# Altium project VESC_MotorController.PrjPcb
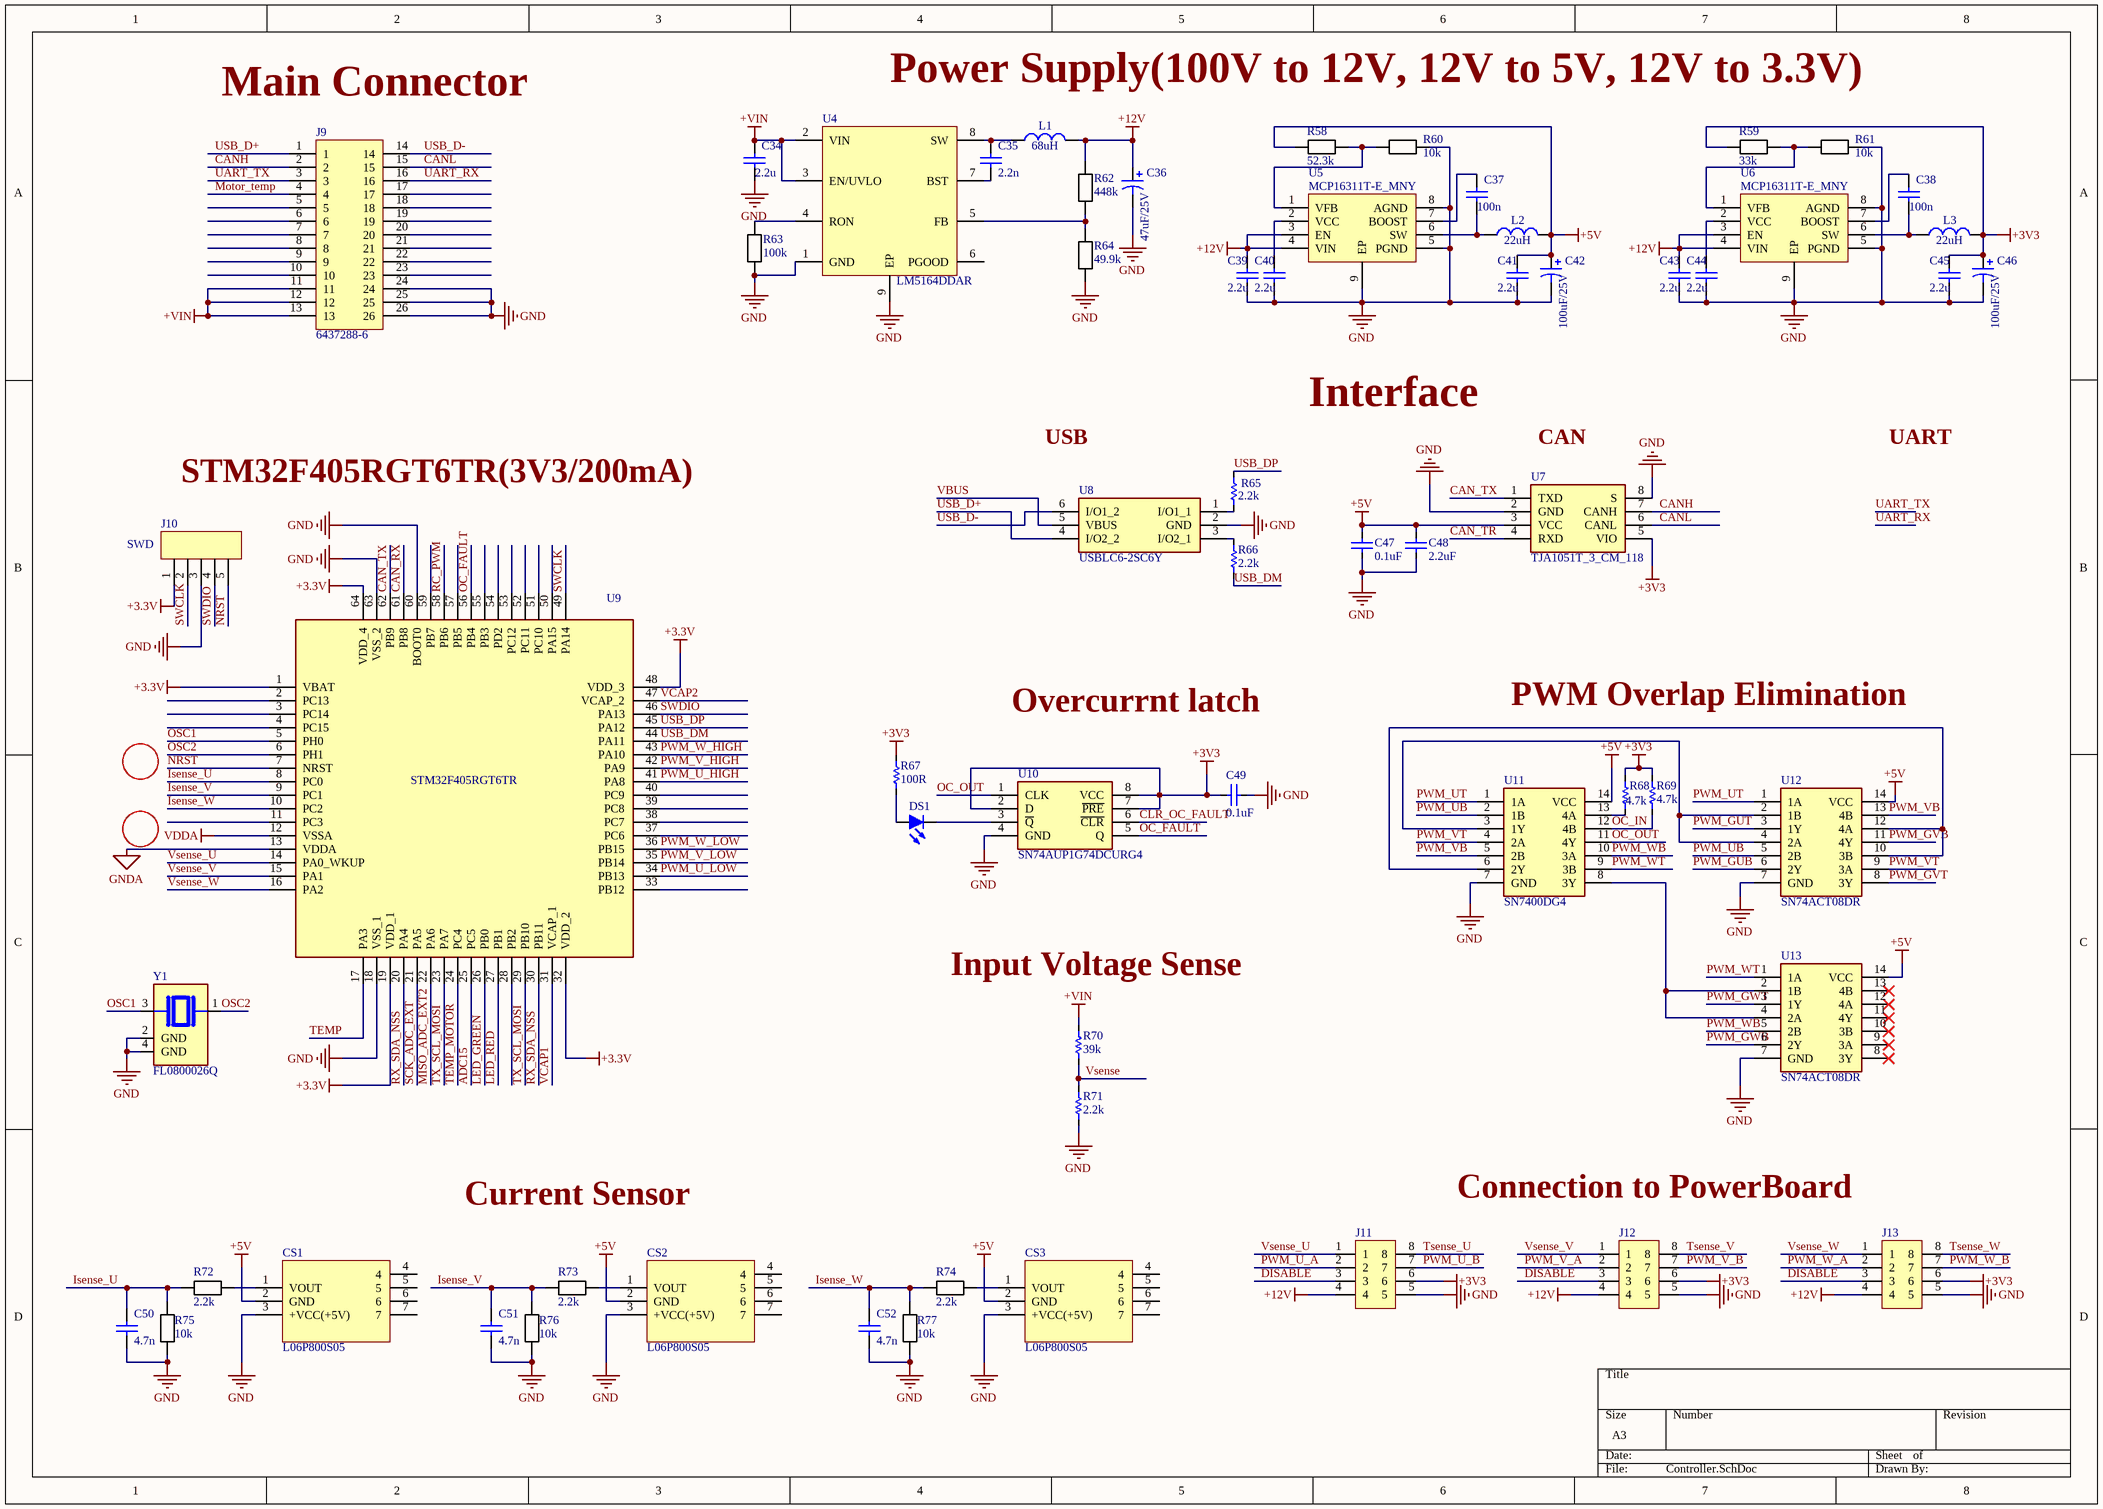
[diagram p0: Controller.SchDoc]
2 sheets, 193 parts. Net scope: global (net labels, ports and power ports of the same name join across sheets).
Board files: Controller.PcbDoc, PowerBoard.PcbDoc
Sheets:
  Controller.SchDoc
  PowerBoard.SchDoc

## Sheet Controller.SchDoc
size A3

### Parts
C34  2.2u  [*]
C35  2.2n  [C0603]
C36  47uF/25V  [*]
C37  100n  [C0603]
C38  100n  [C0603]
C39  2.2u  [*]
C40  2.2u  [*]
C41  2.2u  [*]
C42  100uF/25V  [*]
C43  2.2u  [*]
C44  2.2u  [*]
C45  2.2u  [*]
C46  100uF/25V  [*]
C47  0.1uF  [SMD_C(0402)]
C48  2.2uF  [SMD_C(0603)]
C49  0.1uF  [SMD_C(0402)]
C50  4.7n  [C0603]
C51  4.7n  [C0603]
C52  4.7n  [C0603]
CS1  L06P800S05  [L06P800S05]
CS2  L06P800S05  [L06P800S05]
CS3  L06P800S05  [L06P800S05]
DS1  SML-D12U1WT86  [LED0603]  (value not drawn)
J9  6437288-6  [64372886]
J10  SWD  [Header-2.54m-5pin]
J11  (no value)  [*]
J12  (no value)  [*]
J13  (no value)  [*]
L1  68uH  [*]
L2  22uH  [*]
L3  22uH  [*]
R58  52.3k  [R0603]
R59  33k  [R0603]
R60  10k  [R0603]
R61  10k  [R0603]
R62  448k  [R0603]
R63  100k  [R0603]
R64  49.9k  [R0603]
R65  2.2k  [SMD_R(0402)]
R66  2.2k  [SMD_R(0402)]
R67  100R  [SMD_R(0402)]
R68  4.7k  [SMD_R(0402)]
R69  4.7k  [SMD_R(0402)]
R70  39k  [SMD_R(0402)]
R71  2.2k  [SMD_R(0402)]
R72  2.2k  [R0603]
R73  2.2k  [R0603]
R74  2.2k  [R0603]
R75  10k  [R0603]
R76  10k  [R0603]
R77  10k  [R0603]
U4  LM5164DDAR  [SOIC-8(EPAD)]
U5  MCP16311T-E_MNY  [MSOP-8]
U6  MCP16311T-E_MNY  [MSOP-8]
U7  TJA1051T_3_CM_118  [SOIC127P600X175-8N]
U8  USBLC6-2SC6Y  [SOT95P280X145-6N]
U9  STM32F405RGT6TR  [QFP50P1200X1200X160-64N]
U10  SN74AUP1G74DCURG4  [SOP50P310X90-8N]
U11  SN7400DG4  [SOIC127P600X175-14N]
U12  SN74ACT08DR  [SOIC127P600X175-14N]
U13  SN74ACT08DR  [SOIC127P600X175-14N]
Y1  FL0800026Q  [XTAL_FL0800026Q]

### Nets
+3.3V: J10.1 U9.1(VBAT) U9.19(VDD_1) U9.32(VDD_2) U9.48(VDD_3) U9.64(VDD_4)
+3V3: C45.2 C46.1 C49.2 J11.6 J12.6 J13.6 L3.2 R59.1 R67.2 R68.2 R69.2 U7.5(VIO) U10.2(D) U10.7(~{PRE}) U10.8(VCC)
+5V: C41.2 C42.1 C47.2 C48.2 CS1.2(GND) CS2.2(GND) CS3.2(GND) L2.2 R58.1 U7.3(VCC) U11.14(VCC) U12.14(VCC) U13.14(VCC)
+12V: C36.1 C39.2 C43.2 J11.4 J12.4 J13.4 L1.2 R62.2 U5.3(EN) U5.4(VIN) U6.3(EN) U6.4(VIN)
+VIN: C34.2 J9.11 J9.12 J9.13 R70.2 U4.2(VIN) U4.3(EN/UVLO)
GND: C34.1 C36.2 C39.1 C40.1 C41.1 C42.2 C43.1 C44.1 C45.1 C46.2 C47.1 C48.1 C49.1 C50.1 C51.1 C52.1 CS1.3(+VCC(+5V)) CS2.3(+VCC(+5V)) CS3.3(+VCC(+5V)) J9.24 J9.25 J9.26 J10.3 J11.5 J12.5 J13.5 R60.1 R61.1 R63.1 R64.1 R71.1 R75.1 R76.1 R77.1 U4.1(GND) U4.9(EP) U5.5(PGND) U5.8(AGND) U5.9(EP) U6.5(PGND) U6.8(AGND) U6.9(EP) U7.2(GND) U7.8(S) U8.2(GND) U9.18(VSS_1) U9.60(BOOT0) U9.63(VSS_2) U10.4(GND) U11.7(GND) U12.7(GND) U13.7(GND) Y1.2(GND) Y1.4(GND)
GNDA: U9.13(VDDA)
VDDA: U9.12(VSSA)
ADC15: U9.25(PC5)
CAN_RX: U9.61(PB8)
CAN_TR: U7.4(RXD)
CAN_TX: U7.1(TXD) U9.62(PB9)
CANH: J9.2 U7.7(CANH)
CANL: J9.15 U7.6(CANL)
CLR_OC_FAULT: U10.6(~{CLR})
DISABLE: J11.3 J12.3 J13.3
Isense_U: C50.2 R72.1 R75.2 U9.8(PC0)
Isense_V: C51.2 R73.1 R76.2 U9.9(PC1)
Isense_W: C52.2 R74.1 R77.2 U9.10(PC2)
LED_GREEN: U9.26(PB0)
LED_RED: U9.27(PB1)
MISO_ADC_EXT2: U9.22(PA6)
Motor_temp: J9.4
NRST: J10.5 U9.7(NRST)
OC_FAULT: U9.56(PB4) U10.5(Q)
OC_IN: R69.1 U11.12(4B)
OC_OUT: U10.1(CLK) U11.11(4Y)
OSC1: U9.5(PH0) Y1.3
OSC2: U9.6(PH1) Y1.1
PWM_GUB: U12.6(2Y)
PWM_GUT: U12.3(1Y)
PWM_GVB: U12.11(4Y)
PWM_GVT: U12.8(3Y)
PWM_GWB: U13.6(2Y)
PWM_GWT: U13.3(1Y)
PWM_U_A: J11.2
PWM_U_B: J11.7
PWM_U_HIGH: U9.41(PA8)
PWM_U_LOW: U9.34(PB13)
PWM_UB: U11.2(1B) U12.5(2B)
PWM_UT: U11.1(1A) U12.1(1A)
PWM_V_A: J12.2
PWM_V_B: J12.7
PWM_V_HIGH: U9.42(PA9)
PWM_V_LOW: U9.35(PB14)
PWM_VB: U11.5(2B) U12.13(4B)
PWM_VT: U11.4(2A) U12.9(3A)
PWM_W_A: J13.2
PWM_W_B: J13.7
PWM_W_HIGH: U9.43(PA10)
PWM_W_LOW: U9.36(PB15)
PWM_WB: U11.10(3A) U13.5(2B)
PWM_WT: U11.9(3B) U13.1(1A)
RC_PWM: U9.58(PB6)
RX_SDA_NSS: U9.20(PA4) U9.30(PB11)
SCK_ADC_EXT: U9.21(PA5)
SWCLK: J10.2 U9.49(PA14)
SWDIO: J10.4 U9.46(PA13)
TEMP: U9.17(PA3)
TEMP_MOTOR: U9.24(PC4)
Tsense_U: J11.8
Tsense_V: J12.8
Tsense_W: J13.8
TX_SCL_MOSI: U9.23(PA7) U9.29(PB10)
UART_RX: J9.16
UART_TX: J9.3
USB_D+: J9.1 U8.4(I/O2_2)
USB_D-: J9.14 U8.6(I/O1_2)
USB_DM: R66.2 U9.44(PA11)
USB_DP: R65.2 U9.45(PA12)
VBUS: U8.5(VBUS)
VCAP1: U9.31(VCAP_1)
VCAP2: U9.47(VCAP_2)
Vsense: R70.1 R71.2
Vsense_U: J11.1 U9.14(PA0_WKUP)
Vsense_V: J12.1 U9.15(PA1)
Vsense_W: J13.1 U9.16(PA2)
NetC35_1: C35.1 U4.7(BST)
NetC35_2: C35.2 L1.1 U4.8(SW)
NetC37_1: C37.1 L2.1 U5.6(SW)
NetC37_2: C37.2 U5.7(BOOST)
NetC38_1: C38.1 L3.1 U6.6(SW)
NetC38_2: C38.2 U6.7(BOOST)
NetC40_2: C40.2 U5.2(VCC)
NetC44_2: C44.2 U6.2(VCC)
NetCS1_1: CS1.1(VOUT) R72.2
NetCS2_1: CS2.1(VOUT) R73.2
NetCS3_1: CS3.1(VOUT) R74.2
NetDS1_A: DS1.A R67.1
NetDS1_C: DS1.C U10.3(~{Q})
NetR58_2: R58.2 R60.2 U5.1(VFB)
NetR59_2: R59.2 R61.2 U6.1(VFB)
NetR62_1: R62.1 R64.2 U4.5(FB)
NetR63_2: R63.2 U4.4(RON)
NetR65_1: R65.1 U8.1(I/O1_1)
NetR66_1: R66.1 U8.3(I/O2_1)
NetR68_1: R68.1 U11.13(4A)
NetU11_3: U11.3(1Y) U12.2(1B) U12.4(2A)
NetU11_6: U11.6(2Y) U12.10(3B) U12.12(4A)
NetU11_8: U11.8(3Y) U13.2(1B) U13.4(2A)

Not connected (* = marked no-connect by the designer): CS1 4 5 6 7; CS2 4 5 6 7; CS3 4 5 6 7; J9 5 6 7 8 9 10 17 18 19 20 21 22 23; U4 6(PGOOD); U9 2(PC13) 3(PC14) 4(PC15) 11(PC3) 28(PB2) 33(PB12) 37(PC6) 38(PC7) 39(PC8) 40(PC9) 50(PA15) 51(PC10) 52(PC11) 53(PC12) 54(PD2) 55(PB3) 57(PB5) 59(PB7); U13 8(3Y)* 9(3A)* 10(3B)* 11(4Y)* 12(4A)* 13(4B)*

### Notes on the sheet
- (near J9) Main Connector
- Power Supply(100V to 12V, 12V to 5V, 12V to 3.3V)
- USB
- Interface
- (near U7) CAN
- UART
- STM32F405RGT6TR(3V3/200mA)
- Overcurrnt latch
- PWM Overlap Elimination
- (near R70) Input Voltage Sense
- Current Sensor
- Connection to PowerBoard

### Library data of the parts
C34 = 2.2uF ± 10% 100V: Value: 2.2u
C35 = 2.2nF ± 10% 50V: Manufacturer: Yageo; Price: 0.1; Supplier: Mouser; Value: 2.2n
C36 = Cap Pol1: 47uF ±20% 25V; Value: 47uF/25V
C37 C38 = 100nF ± 10% 50V: Manufacturer: Yageo; Manufacturer Part Number: CC0603KRX7R9BB104; Supplier Part Number: 603-CC603KRX7R9BB104; Price: 0.1; Supplier: Mouser; Value: 100n
C39-C41 C43-C45 = 2.2uF ± 10% 25V: Value: 2.2u
C42 C46 = Cap Pol1: 100uF ±20% 25V; Value: 100uF/25V
C47 C49 = Cap_1: Multilayer Ceramic Capacitors MLCC - SMD/SMT 50 V 0.1uF X7R 0603 10%; Manufacturer: Yageo; Manufacturer Part Number: CC0603KPX7R9BB104; Supplier 1: Digi-Key; Supplier Part Number 1: 311-3567-1-ND
C48 = Cap_4: Multilayer Ceramic Capacitors MLCC - SMD/SMT 2.2 uF 50 VDC 10% 1206 X7R AEC-Q200; Manufacturer: Yageo; Manufacturer Part Number: GCM31CR71H225KA55K; Supplier 1: Digi-Key; Supplier Part Number 1: 311-3567-1-ND
C50-C52 = 4.7nF ± 10% 50V: Manufacturer: Yageo; Price: 0.1; Supplier: Mouser; Value: 4.7n
CS1-CS3 = L06P800S05: Board Mount Current Sensors Current Sensor, +/-800A, +5VDC, PCB, Open Loop, Aperture, 2.5V+/-1.5V Output; Manufacturer: Tamura; Supplier Part Number: 838-L06P800S05; Price: 20; Manufacturer Part Number: L06P800S05; Value: L06P800S05; Supplier: Mouser
DS1 = SML-D12U1WT86: Typical RED GaAs LED; Manufacturer: Rohm Semiconductor; Supplier: Mouser; Supplier Part Number: 755-SML-D12U1WT86; Manufacturer Part Number: SML-D12U1WT86; Value: SML-D12U1WT86; Price: 0.2
J9 = 6437288-6: Header vert 26 way 4 row Tab Superseal; Manufacturer: TE Connectivity; Supplier Part Number: 571-6437288-6; Manufacturer Part Number: 6437288-6; Supplier: Mouser; Value: 6437288-6
J10 = 5PinConnector
J11-J13 = PCB Header: 2 Row 2.54mm Pitch 8 pins
L1-L3 = Inductor
  L1: Value: 68uH
  L2 L3: Value: 22uH
R58 = 52.3 kohm 0.1W ±1%: Manufacturer Part Number: RC0603FR-0752K3L; Manufacturer: Yageo; Value: 52.3k; Supplier: Mouser; Supplier Part Number: 603-RC0603FR-0752K3L; Price: 0.1
R59 = 33 kohm 0.1W ±1%: Manufacturer Part Number: RC0603FR-0733KL; Manufacturer: Yageo; Value: 33k; Supplier: Mouser; Supplier Part Number: 603-RC0603FR-0733KL; Price: 0.1
R60 R61 R75-R77 = 10 kohm 0.1W ±1%: Manufacturer Part Number: RC0603FR-0710KL; Manufacturer: Yageo; Value: 10k; Supplier: Mouser; Supplier Part Number: 603-RC0603FR-0710KL; Price: 0.1
R62 = 448 kohm 0.1W ±1%: Manufacturer Part Number: RC0603FR-07448KL; Manufacturer: Yageo; Value: 448k; Supplier: Mouser; Supplier Part Number: 603-RC0603FR-07448KL; Price: 0.1
R63 = 100 kohm 0.1W ±1%: Manufacturer Part Number: RC0603FR-07100KL; Manufacturer: Yageo; Value: 100k; Supplier: Mouser; Supplier Part Number: 603-RC0603FR-07100KL; Price: 0.1
R64 = 49.9 kohm 0.1W ±1%: Manufacturer Part Number: RC0603FR-0749K9L; Manufacturer: Yageo; Value: 49.9k; Supplier: Mouser; Supplier Part Number: 603-RC0603FR-0749K9L; Price: 0.1
R65 R66 = Res Semi_2: CRCW04024R02FKED; Published: 8-Jun-2000; LatestRevisionDate: 17-Jul-2002; LatestRevisionNote: Re-released for DXP Platform.; PackageReference: AXIAL-0.5; Publisher: Altium Limited; PackageDescription: Axial Device, Thru-Hole; 2 Leads; 0.5 in Pin Spacing
R67 = Res Semi_1: CRCW04024R02FKED; Published: 8-Jun-2000; LatestRevisionDate: 17-Jul-2002; LatestRevisionNote: Re-released for DXP Platform.; PackageReference: AXIAL-0.5; Publisher: Altium Limited; PackageDescription: Axial Device, Thru-Hole; 2 Leads; 0.5 in Pin Spacing
R68 R69 = Res Semi_3: CRCW04024R02FKED; Published: 8-Jun-2000; LatestRevisionDate: 17-Jul-2002; LatestRevisionNote: Re-released for DXP Platform.; PackageReference: AXIAL-0.5; Publisher: Altium Limited; PackageDescription: Axial Device, Thru-Hole; 2 Leads; 0.5 in Pin Spacing
R70 R71 = Res Semi_5: CRCW04024R02FKED; Published: 8-Jun-2000; LatestRevisionDate: 17-Jul-2002; LatestRevisionNote: Re-released for DXP Platform.; PackageReference: AXIAL-0.5; Publisher: Altium Limited; PackageDescription: Axial Device, Thru-Hole; 2 Leads; 0.5 in Pin Spacing
R72-R74 = 2.2 kohm 0.1W ±1%: Manufacturer Part Number: RC0603FR-072K2L; Manufacturer: Yageo; Value: 2.2k; Supplier: Mouser; Supplier Part Number: 603-RC0603FR-072K2L; Price: 0.1
U4 = LM5164DDAR: Texas Instruments 6-V to 100-V Input, 1-A Synchronous Buck DC-DC Converter With Ultra-Low IQ 8-SO PowerPAD -40 to 150; Value: 1.7mm; Supplier Part Number: 595-LM5164DDAR; Price: 3.5; Manufacturer: Texas Instruments; Manufacturer Part Number: LM5164DDAR; Supplier: Mouser
U5 U6 = MCP16311T-E_MNY: Microchip, MCP16311T-E/MNY Step Down DC-DC Converter 1A Adjustable, 2  24 V 8-Pin, TDFN; Supplier Part Number: 579-MCP16311T-E/MNY; Price: 1.8; Manufacturer: Microchip; Manufacturer Part Number: MCP16311T-E/MNY; Value: MCP16311T-E/MNY; Supplier: Mouser
U7 = TJA1051T_3_CM_118: CAN Interface IC BL Advanced Automotive Analog; Manufacturer_Name: NXP; Manufacturer_Part_Number: TJA1051T/3/CM,118; Geometry.Height: 1.75mm; Mouser Part Number: 771-TJA1051T/3CM118; Mouser Price/Stock: https://www.mouser.co.uk/ProductDetail/NXP-Semiconductors/TJA1051T-3-CM118?qs=5XOdhvmYM0NUkmo%252BpXvJfw%3D%3D; Datasheet Link: http://www.nxp.com/docs/en/data-sheet/TJA1051.pdf
U8 = USBLC6-2SC6Y: Low Cap. ESD Protection Auto SOT-23-6 STMicroelectronics USBLC6-2SC6Y, Dual Uni-Directional TVS Diode Array, 6-Pin SOT-23; Geometry.Height: 1.45mm; Mouser Part Number: 511-USBLC6-2SC6Y; Mouser Price/Stock: https://www.mouser.co.uk/ProductDetail/STMicroelectronics/USBLC6-2SC6Y?qs=gNDSiZmRJS%2FOgDexvXkdow%3D%3D; Manufacturer_Name: STMicroelectronics; Manufacturer_Part_Number: USBLC6-2SC6Y; Datasheet Link: https://componentsearchengine.com/Datasheets/1/USBLC6-2SC6Y.pdf
U9 = STM32F405RGT6TR: STM32F405RGT6TR, 32 bit ARM Cortex M4 MCU 168MHz 1024 kB Flash, 192 kB RAM, 2xUSB CAN I2C 64-Pin LQFP; Manufacturer_Name: STMicroelectronics; Geometry.Height: 1.6mm; Mouser Part Number: 511-STM32F405RGT6TR; Mouser Price/Stock: https://www.mouser.co.uk/ProductDetail/STMicroelectronics/STM32F405RGT6TR?qs=MavH1QghrkHshpR6GkvPIg%3D%3D; Manufacturer_Part_Number: STM32F405RGT6TR; Datasheet Link: http://www.st.com/web/en/resource/technical/document/datasheet/DM00037051.pdf
U10 = SN74AUP1G74DCURG4: Flip Flops Lo PWR SNGL Pos Edge Trgrd DType FlipFlop; Manufacturer_Name: Texas Instruments; Geometry.Height: 0.9mm; Mouser Part Number: 595-74AUP1G74DCURG4; Mouser Price/Stock: https://www.mouser.co.uk/ProductDetail/Texas-Instruments/SN74AUP1G74DCURG4?qs=7kv20MEVUlhYDCdFtbMd%2FA%3D%3D; Manufacturer_Part_Number: SN74AUP1G74DCURG4; Datasheet Link: *
U11 = SN7400DG4: NAND Gate 4-Element 2-IN Bipolar 14-Pin SOIC Tube; Manufacturer_Name: Texas Instruments; Geometry.Height: 1.75mm; Mouser Part Number: 595-SN7400DG4; Mouser Price/Stock: https://www.mouser.co.uk/ProductDetail/Texas-Instruments/SN7400DG4?qs=E8lYj0tdJGGtKkNRXTqCCA%3D%3D; Manufacturer_Part_Number: SN7400DG4; Datasheet Link: https://www.arrow.com/en/products/sn7400dg4/texas-instruments
U12 U13 = SN74ACT08DR: Texas Instruments SN74ACT08DR, AND Quad 2 Input AND, 4.5  5.5 V, 14-Pin SOIC; Geometry.Height: 1.75mm; Mouser Part Number: 595-SN74ACT08DR; Mouser Price/Stock: https://www.mouser.co.uk/ProductDetail/Texas-Instruments/SN74ACT08DR?qs=AMJt07B76uu%2FkRdXJtIwhw%3D%3D; Manufacturer_Name: Texas Instruments; Manufacturer_Part_Number: SN74ACT08DR; Datasheet Link: http://www.ti.com/lit/gpn/sn74act08
Y1 = FL0800026Q: 8 MHz Â±30ppm Crystal 8pF 400 Ohms 4-SMD, No Lead; MF: Diodes Incorporated; Package: NON STANDARD-4 Diodes Inc.; Price: None; Check_prices: https://www.snapeda.com/parts/FL0800026Q/Diodes+Inc./view-part/?ref=eda; Value: *; SnapEDA_Link: https://www.snapeda.com/parts/FL0800026Q/Diodes+Inc./view-part/?ref=snap; MP: FL0800026Q; Availability: In Stock; Purchase-URL: https://pricing.snapeda.com/search?q=FL0800026Q&ref=eda

## Sheet PowerBoard.SchDoc: DriveHUB CardFrame - Backplane Power
size A3; Date: 01/08/22; Engineer: AJC; DocumentNumber: 35-735; Revision: D; SheetNumber: 1; SheetTotal: 3; Manager: AJC
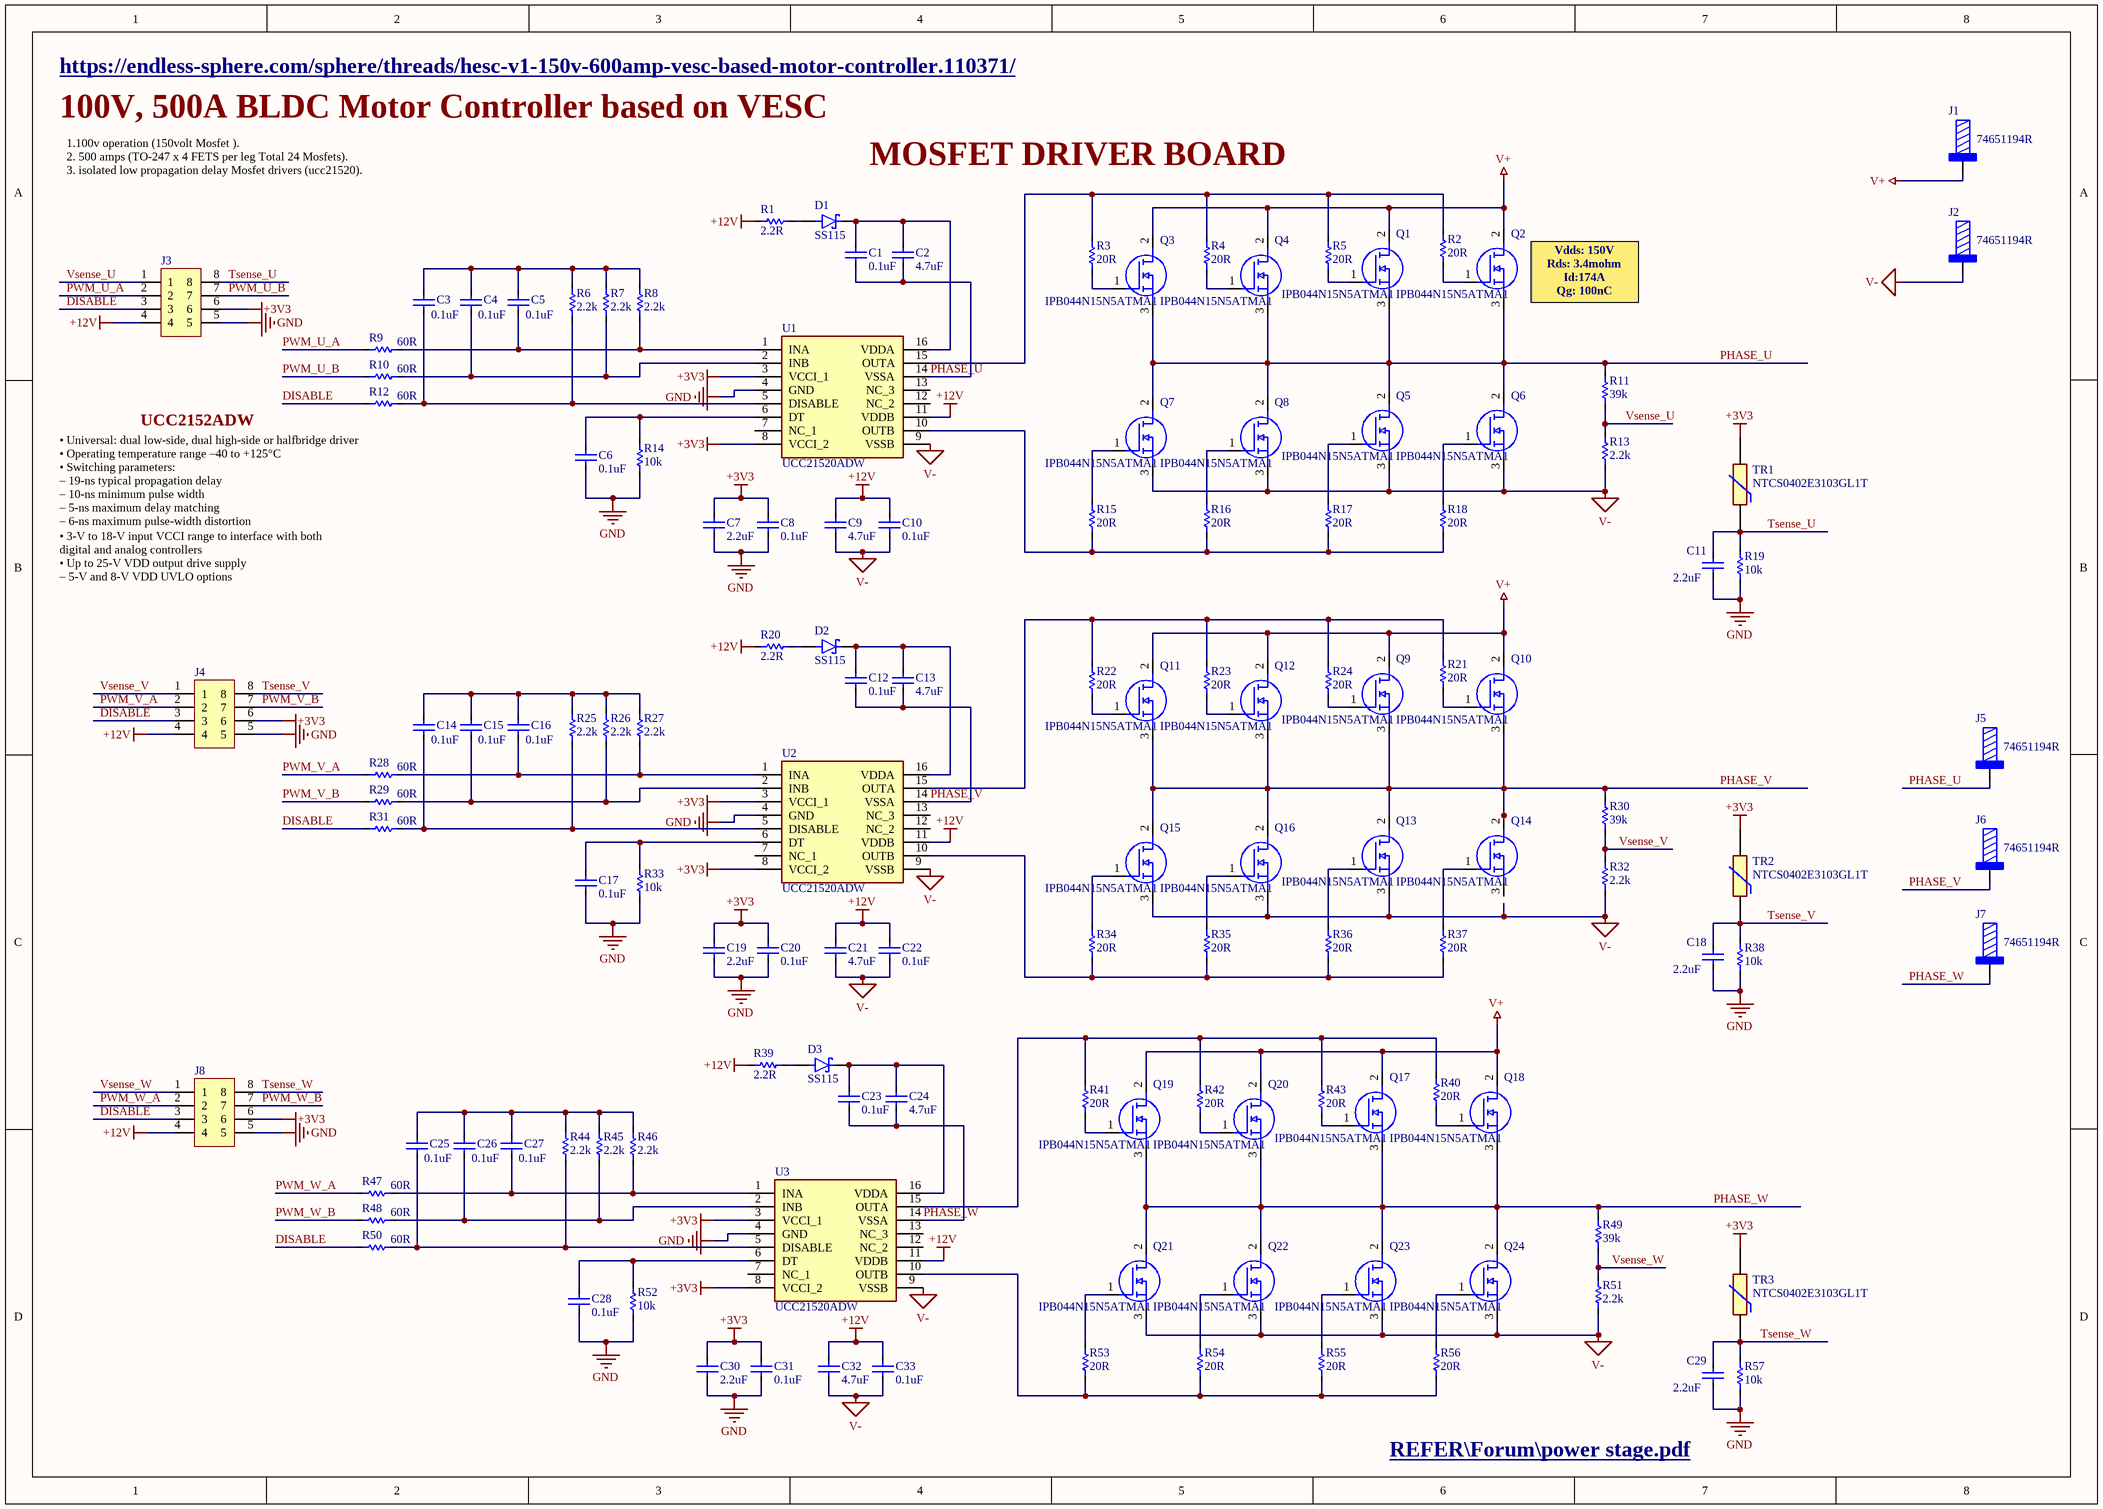
[diagram p1: PowerBoard.SchDoc]

### Parts
C1  0.1uF  [SMD_C(0402)]
C2  4.7uF  [SMD_C(0603)]
C3  0.1uF  [SMD_C(0402)]
C4  0.1uF  [SMD_C(0402)]
C5  0.1uF  [SMD_C(0402)]
C6  0.1uF  [SMD_C(0402)]
C7  2.2uF  [SMD_C(0603)]
C8  0.1uF  [SMD_C(0402)]
C9  4.7uF  [SMD_C(0603)]
C10  0.1uF  [SMD_C(0402)]
C11  2.2uF  [SMD_C(0402)]
C12  0.1uF  [SMD_C(0402)]
C13  4.7uF  [SMD_C(0603)]
C14  0.1uF  [SMD_C(0402)]
C15  0.1uF  [SMD_C(0402)]
C16  0.1uF  [SMD_C(0402)]
C17  0.1uF  [SMD_C(0402)]
C18  2.2uF  [SMD_C(0402)]
C19  2.2uF  [SMD_C(0603)]
C20  0.1uF  [SMD_C(0402)]
C21  4.7uF  [SMD_C(0603)]
C22  0.1uF  [SMD_C(0402)]
C23  0.1uF  [SMD_C(0402)]
C24  4.7uF  [SMD_C(0603)]
C25  0.1uF  [SMD_C(0402)]
C26  0.1uF  [SMD_C(0402)]
C27  0.1uF  [SMD_C(0402)]
C28  0.1uF  [SMD_C(0402)]
C29  2.2uF  [SMD_C(0402)]
C30  2.2uF  [SMD_C(0603)]
C31  0.1uF  [SMD_C(0402)]
C32  4.7uF  [SMD_C(0603)]
C33  0.1uF  [SMD_C(0402)]
D1  SS115  [DIOM4325X250N]
D2  SS115  [DIOM4325X250N]
D3  SS115  [DIOM4325X250N]
J1  74651194R  [74651194]
J2  74651194R  [74651194]
J3  (no value)  [*]
J4  (no value)  [*]
J5  74651194R  [74651194]
J6  74651194R  [74651194]
J7  74651194R  [74651194]
J8  (no value)  [*]
Q1  IPB044N15N5ATMA1  [TO546P531X1558X2499-3P]
Q2  IPB044N15N5ATMA1  [TO546P531X1558X2499-3P]
Q3  IPB044N15N5ATMA1  [TO546P531X1558X2499-3P]
Q4  IPB044N15N5ATMA1  [TO546P531X1558X2499-3P]
Q5  IPB044N15N5ATMA1  [TO546P531X1558X2499-3P]
Q6  IPB044N15N5ATMA1  [TO546P531X1558X2499-3P]
Q7  IPB044N15N5ATMA1  [TO546P531X1558X2499-3P]
Q8  IPB044N15N5ATMA1  [TO546P531X1558X2499-3P]
Q9  IPB044N15N5ATMA1  [TO546P531X1558X2499-3P]
Q10  IPB044N15N5ATMA1  [TO546P531X1558X2499-3P]
Q11  IPB044N15N5ATMA1  [TO546P531X1558X2499-3P]
Q12  IPB044N15N5ATMA1  [TO546P531X1558X2499-3P]
Q13  IPB044N15N5ATMA1  [TO546P531X1558X2499-3P]
Q14  IPB044N15N5ATMA1  [TO546P531X1558X2499-3P]
Q15  IPB044N15N5ATMA1  [TO546P531X1558X2499-3P]
Q16  IPB044N15N5ATMA1  [TO546P531X1558X2499-3P]
Q17  IPB044N15N5ATMA1  [TO546P531X1558X2499-3P]
Q18  IPB044N15N5ATMA1  [TO546P531X1558X2499-3P]
Q19  IPB044N15N5ATMA1  [TO546P531X1558X2499-3P]
Q20  IPB044N15N5ATMA1  [TO546P531X1558X2499-3P]
Q21  IPB044N15N5ATMA1  [TO546P531X1558X2499-3P]
Q22  IPB044N15N5ATMA1  [TO546P531X1558X2499-3P]
Q23  IPB044N15N5ATMA1  [TO546P531X1558X2499-3P]
Q24  IPB044N15N5ATMA1  [TO546P531X1558X2499-3P]
R1  2.2R  [SMD_R(0402)]
R2  20R  [SMD_R(0402)]
R3  20R  [SMD_R(0402)]
R4  20R  [SMD_R(0402)]
R5  20R  [SMD_R(0402)]
R6  2.2k  [SMD_R(0402)]
R7  2.2k  [SMD_R(0402)]
R8  2.2k  [SMD_R(0402)]
R9  60R  [SMD_R(0402)]
R10  60R  [SMD_R(0402)]
R11  39k  [SMD_R(0402)]
R12  60R  [SMD_R(0402)]
R13  2.2k  [SMD_R(0402)]
R14  10k  [SMD_R(0402)]
R15  20R  [SMD_R(0402)]
R16  20R  [SMD_R(0402)]
R17  20R  [SMD_R(0402)]
R18  20R  [SMD_R(0402)]
R19  10k  [SMD_R(0402)]
R20  2.2R  [SMD_R(0402)]
R21  20R  [SMD_R(0402)]
R22  20R  [SMD_R(0402)]
R23  20R  [SMD_R(0402)]
R24  20R  [SMD_R(0402)]
R25  2.2k  [SMD_R(0402)]
R26  2.2k  [SMD_R(0402)]
R27  2.2k  [SMD_R(0402)]
R28  60R  [SMD_R(0402)]
R29  60R  [SMD_R(0402)]
R30  39k  [SMD_R(0402)]
R31  60R  [SMD_R(0402)]
R32  2.2k  [SMD_R(0402)]
R33  10k  [SMD_R(0402)]
R34  20R  [SMD_R(0402)]
R35  20R  [SMD_R(0402)]
R36  20R  [SMD_R(0402)]
R37  20R  [SMD_R(0402)]
R38  10k  [SMD_R(0402)]
R39  2.2R  [SMD_R(0402)]
R40  20R  [SMD_R(0402)]
R41  20R  [SMD_R(0402)]
R42  20R  [SMD_R(0402)]
R43  20R  [SMD_R(0402)]
R44  2.2k  [SMD_R(0402)]
R45  2.2k  [SMD_R(0402)]
R46  2.2k  [SMD_R(0402)]
R47  60R  [SMD_R(0402)]
R48  60R  [SMD_R(0402)]
R49  39k  [SMD_R(0402)]
R50  60R  [SMD_R(0402)]
R51  2.2k  [SMD_R(0402)]
R52  10k  [SMD_R(0402)]
R53  20R  [SMD_R(0402)]
R54  20R  [SMD_R(0402)]
R55  20R  [SMD_R(0402)]
R56  20R  [SMD_R(0402)]
R57  10k  [SMD_R(0402)]
TR1  NTCS0402E3103GL1T  [THRMC1005X65N]
TR2  NTCS0402E3103GL1T  [THRMC1005X65N]
TR3  NTCS0402E3103GL1T  [THRMC1005X65N]
U1  UCC21520ADW  [SOIC127P1030X265-16N]
U2  UCC21520ADW  [SOIC127P1030X265-16N]
U3  UCC21520ADW  [SOIC127P1030X265-16N]

### Nets
+3V3: C7.2 C8.2 C19.2 C20.2 C30.2 C31.2 J3.6 J4.6 J8.6 TR1.2 TR2.2 TR3.2 U1.3(VCCI_1) U1.8(VCCI_2) U2.3(VCCI_1) U2.8(VCCI_2) U3.3(VCCI_1) U3.8(VCCI_2)
+12V: C9.2 C10.2 C21.2 C22.2 C32.2 C33.2 J3.4 J4.4 J8.4 R1.1 R20.1 R39.1 U1.11(VDDB) U2.11(VDDB) U3.11(VDDB)
GND: C6.1 C7.1 C8.1 C11.1 C17.1 C18.1 C19.1 C20.1 C28.1 C29.1 C30.1 C31.1 J3.5 J4.5 J8.5 R14.1 R19.1 R33.1 R38.1 R52.1 R57.1 U1.4(GND) U2.4(GND) U3.4(GND)
V+: J1.1 Q1.2(D) Q2.2(D) Q3.2(D) Q4.2(D) Q9.2(D) Q10.2(D) Q11.2(D) Q12.2(D) Q17.2(D) Q18.2(D) Q19.2(D) Q20.2(D)
V-: C9.1 C10.1 C21.1 C22.1 C32.1 C33.1 J2.1 Q5.3(S) Q6.3(S) Q7.3(S) Q8.3(S) Q13.3(S) Q15.3(S) Q16.3(S) Q21.3(S) Q22.3(S) Q23.3(S) Q24.3(S) R13.1 R32.1 R51.1 U1.9(VSSB) U2.9(VSSB) U3.9(VSSB)
DISABLE: J3.3 J4.3 J8.3 R12.1 R31.1 R50.1
PHASE_U: C1.1 C2.1 J5.1 Q1.3(S) Q2.3(S) Q3.3(S) Q4.3(S) Q5.2(D) Q6.2(D) Q7.2(D) Q8.2(D) R11.2 U1.14(VSSA)
PHASE_V: C12.1 C13.1 J6.1 Q9.3(S) Q10.3(S) Q11.3(S) Q12.3(S) Q13.2(D) Q14.2(D) Q15.2(D) Q16.2(D) R30.2 U2.14(VSSA)
PHASE_W: C23.1 C24.1 J7.1 Q17.3(S) Q18.3(S) Q19.3(S) Q20.3(S) Q21.2(D) Q22.2(D) Q23.2(D) Q24.2(D) R49.2 U3.14(VSSA)
PWM_U_A: J3.2 R9.1
PWM_U_B: J3.7 R10.1
PWM_V_A: J4.2 R28.1
PWM_V_B: J4.7 R29.1
PWM_W_A: J8.2 R47.1
PWM_W_B: J8.7 R48.1
Tsense_U: C11.2 J3.8 R19.2 TR1.1
Tsense_V: C18.2 J4.8 R38.2 TR2.1
Tsense_W: C29.2 J8.8 R57.2 TR3.1
Vsense_U: J3.1 R11.1 R13.2
Vsense_V: J4.1 R30.1 R32.2
Vsense_W: J8.1 R49.1 R51.2
NetC1_2: C1.2 C2.2 D1.C(K) U1.16(VDDA)
NetC3_1: C3.1 R6.1 R12.2 U1.5(DISABLE)
NetC3_2: C3.2 C4.2 C5.2 R6.2 R7.2 R8.2
NetC4_1: C4.1 R7.1 R10.2 U1.2(INB)
NetC5_1: C5.1 R8.1 R9.2 U1.1(INA)
NetC6_2: C6.2 R14.2 U1.6(DT)
NetC12_2: C12.2 C13.2 D2.C(K) U2.16(VDDA)
NetC14_1: C14.1 R25.1 R31.2 U2.5(DISABLE)
NetC14_2: C14.2 C15.2 C16.2 R25.2 R26.2 R27.2
NetC15_1: C15.1 R26.1 R29.2 U2.2(INB)
NetC16_1: C16.1 R27.1 R28.2 U2.1(INA)
NetC17_2: C17.2 R33.2 U2.6(DT)
NetC23_2: C23.2 C24.2 D3.C(K) U3.16(VDDA)
NetC25_1: C25.1 R44.1 R50.2 U3.5(DISABLE)
NetC25_2: C25.2 C26.2 C27.2 R44.2 R45.2 R46.2
NetC26_1: C26.1 R45.1 R48.2 U3.2(INB)
NetC27_1: C27.1 R46.1 R47.2 U3.1(INA)
NetC28_2: C28.2 R52.2 U3.6(DT)
NetD1_A: D1.A R1.2
NetD2_A: D2.A R20.2
NetD3_A: D3.A R39.2
NetQ1_1: Q1.1(G) R5.1
NetQ2_1: Q2.1(G) R2.1
NetQ3_1: Q3.1(G) R3.1
NetQ4_1: Q4.1(G) R4.1
NetQ5_1: Q5.1(G) R17.2
NetQ6_1: Q6.1(G) R18.2
NetQ7_1: Q7.1(G) R15.2
NetQ8_1: Q8.1(G) R16.2
NetQ9_1: Q9.1(G) R24.1
NetQ10_1: Q10.1(G) R21.1
NetQ11_1: Q11.1(G) R22.1
NetQ12_1: Q12.1(G) R23.1
NetQ13_1: Q13.1(G) R36.2
NetQ14_1: Q14.1(G) R37.2
NetQ15_1: Q15.1(G) R34.2
NetQ16_1: Q16.1(G) R35.2
NetQ17_1: Q17.1(G) R43.1
NetQ18_1: Q18.1(G) R40.1
NetQ19_1: Q19.1(G) R41.1
NetQ20_1: Q20.1(G) R42.1
NetQ21_1: Q21.1(G) R53.2
NetQ22_1: Q22.1(G) R54.2
NetQ23_1: Q23.1(G) R55.2
NetQ24_1: Q24.1(G) R56.2
NetR2_2: R2.2 R3.2 R4.2 R5.2 U1.15(OUTA)
NetR15_1: R15.1 R16.1 R17.1 R18.1 U1.10(OUTB)
NetR21_2: R21.2 R22.2 R23.2 R24.2 U2.15(OUTA)
NetR34_1: R34.1 R35.1 R36.1 R37.1 U2.10(OUTB)
NetR40_2: R40.2 R41.2 R42.2 R43.2 U3.15(OUTA)
NetR53_1: R53.1 R54.1 R55.1 R56.1 U3.10(OUTB)

Not connected (* = marked no-connect by the designer): Q14 3(S); U1 7(NC_1) 12(NC_2) 13(NC_3); U2 7(NC_1) 12(NC_2) 13(NC_3); U3 7(NC_1) 12(NC_2) 13(NC_3)

### Notes on the sheet
- https://endless-sphere.com/sphere/threads/hesc-v1-150v-600amp-vesc-based-motor-controller.110371/
- 100V, 500A BLDC Motor Controller based on VESC
- MOSFET DRIVER BOARD
- 1.100v operation (150volt Mosfet ).
  2. 500 amps (TO-247 x 4 FETS per leg Total 24 Mosfets).
  3. isolated low propagation delay Mosfet drivers (ucc21520).
- (near Q2) Vdds: 150V
  Rds: 3.4mohm
  Id:174A
  Qg: 100nC
- UCC2152ADW
- • 3-V to 18-V input VCCI range to interface with both
  digital and analog controllers
  • Up to 25-V VDD output drive supply
  – 5-V and 8-V VDD UVLO options
- (near R12) • Universal: dual low-side, dual high-side or halfbridge driver
  • Operating temperature range –40 to +125°C
  • Switching parameters:
  – 19-ns typical propagation delay
  – 10-ns minimum pulse width
  – 5-ns maximum delay matching
  – 6-ns maximum pulse-width distortion
- REFER\Forum\power stage.pdf

### Library data of the parts
C1 C3-C6 C8 C10 C12 C14-C17 C20 C22 C23 C25-C28 C31 C33 = Cap_1: as C47 on sheet Controller; Supplier 1: Digi-Key; Supplier Part Number 1: 311-3567-1-ND
C2 C7 C9 C13 C19 C21 C24 C30 C32 = Cap_10: PHE840MA6100MA04R17; Manufacturer: Yageo; Manufacturer Part Number: CC0603KPX7R9BB104; Supplier 1: Digi-Key; Supplier Part Number 1: 311-3567-1-ND
C11 C18 C29 = Cap_1: Multilayer Ceramic Capacitors MLCC - SMD/SMT 50 V 0.1uF X7R 0603 10%
D1-D3 = SS115: 1A, 150V, Schottky Rectifier; MF: Taiwan Semiconductor; Package: DO-214AC-2 Taiwan Semiconductor; Check_prices: https://www.snapeda.com/parts/SS115/Taiwan+Semiconductor/view-part/?ref=eda; Value: *; Price: None; Purchase-URL: https://pricing.snapeda.com/search/part/SS115/?ref=eda; MP: SS115; SnapEDA_Link: https://www.snapeda.com/parts/SS115/Taiwan+Semiconductor/view-part/?ref=snap; Availability: In Stock
J1 J2 J5-J7 = 74651194R: WP-THRSH REDCUBE THR with external thread, M4 x 5mm, 85A; Manufacturer: Wurth Elektronik; Surface: Tin; ComponentLink1Description: Website Link; ComponentLink1URL: https://www.we-online.com/redexpert/article/74651194R?ad; ComponentLink2Description: Datasheet Link; ComponentLink2URL: https://www.we-online.com/redexpert/spec/74651194R?ad; Manufacturer Part Number: 74651194R; Category: REDCUBE THR; Match Code: WP-THRSH; Mount: Through Hole Reflow; Operating Temperature Max: 150°C; Operating Temperature Min: -55°C; Packaging: Tape and Reel; Length: 10mm; Width: 10mm; Height: 8.5mm; Material: Brass; Number of Pins: 9; Rated Current: 85A; Thread Length: 5mm; Thread Size: M4; Supplier: Mouser; Supplier Part Number: 710-74651195R; Price: 3.5; Value: 74651194R
J3 J4 J8 = PCB Header: 2 Row 2.54mm Pitch 8 pins
Q1-Q24 = AUIRFP4568: MOSFET N-CHANNEL 100+; Manufacturer_Name: Infineon; Geometry.Height: 5.31mm; Mouser Part Number: 942-AUIRFP4568; Mouser Price/Stock: https://www.mouser.co.uk/ProductDetail/Infineon-IR/AUIRFP4568?qs=m1T3c8F5IUIdoWYie9aRBg%3D%3D; Manufacturer_Part_Number: AUIRFP4568; Datasheet Link: https://www.infineon.com/dgdl/auirfp4568.pdf?fileId=5546d462533600a4015355b1d8751458
R1-R5 R9 R10 R12 R15-R18 R20-R24 R28 R29 R31 R34-R37 R39-R43 R47 R48 R50 R53-R56 = Res Semi_1: CRCW04024R02FKED; Published: 8-Jun-2000; LatestRevisionDate: 17-Jul-2002; LatestRevisionNote: Re-released for DXP Platform.; PackageReference: AXIAL-0.5; Publisher: Altium Limited; PackageDescription: Axial Device, Thru-Hole; 2 Leads; 0.5 in Pin Spacing
R6-R8 R25-R27 R44-R46 = Res Semi_2: CRCW04024R02FKED; Published: 8-Jun-2000; LatestRevisionDate: 17-Jul-2002; LatestRevisionNote: Re-released for DXP Platform.; PackageReference: AXIAL-0.5; Publisher: Altium Limited; PackageDescription: Axial Device, Thru-Hole; 2 Leads; 0.5 in Pin Spacing
R11 R13 R14 R19 R30 R32 R33 R38 R49 R51 R52 R57 = Res Semi_5: CRCW04024R02FKED; Published: 8-Jun-2000; LatestRevisionDate: 17-Jul-2002; LatestRevisionNote: Re-released for DXP Platform.; PackageReference: AXIAL-0.5; Publisher: Altium Limited; PackageDescription: Axial Device, Thru-Hole; 2 Leads; 0.5 in Pin Spacing
TR1-TR3 = NTCS0402E3103GL1T: NTC Thermistors 10Kohms 2% AEC-Q200; Manufacturer_Name: Vishay; Geometry.Height: 0.65mm; Mouser Part Number: 594-NTCS402E3103GL1T; Mouser Price/Stock: https://www.mouser.co.uk/ProductDetail/Vishay-BC-Components/NTCS0402E3103GL1T?qs=u16ybLDytRYI8lwq3wWutw%3D%3D; Manufacturer_Part_Number: NTCS0402E3103GL1T; Datasheet Link: https://www.mouser.in/datasheet/2/427/ntcs0402e3t-1762119.pdf
U1-U3 = UCC21520ADW: 4A/6A, 5.7 kVrms Isolated Dual Channel Gate Driver; Manufacturer_Name: Texas Instruments; Geometry.Height: 2.65mm; Mouser Part Number: 595-UCC21520ADW; Mouser Price/Stock: https://www.mouser.co.uk/ProductDetail/Texas-Instruments/UCC21520ADW?qs=%2FP2Ij7fVdhFsQr%252B%2F6P1laA%3D%3D; Manufacturer_Part_Number: UCC21520ADW; Datasheet Link: http://www.ti.com/lit/gpn/ucc21520

## Nets that join several sheets
+3V3: Controller (15 pins), PowerBoard (18 pins)
+12V: Controller (12 pins), PowerBoard (15 pins)
GND: Controller (54 pins), PowerBoard (24 pins)
DISABLE: Controller (J11.3 J12.3 J13.3), PowerBoard (6 pins)
PWM_U_A: Controller (J11.2), PowerBoard (J3.2 R9.1)
PWM_U_B: Controller (J11.7), PowerBoard (J3.7 R10.1)
PWM_V_A: Controller (J12.2), PowerBoard (J4.2 R28.1)
PWM_V_B: Controller (J12.7), PowerBoard (J4.7 R29.1)
PWM_W_A: Controller (J13.2), PowerBoard (J8.2 R47.1)
PWM_W_B: Controller (J13.7), PowerBoard (J8.7 R48.1)
Tsense_U: Controller (J11.8), PowerBoard (C11.2 J3.8 R19.2 TR1.1)
Tsense_V: Controller (J12.8), PowerBoard (C18.2 J4.8 R38.2 TR2.1)
Tsense_W: Controller (J13.8), PowerBoard (C29.2 J8.8 R57.2 TR3.1)
Vsense_U: Controller (J11.1 U9.14), PowerBoard (J3.1 R11.1 R13.2)
Vsense_V: Controller (J12.1 U9.15), PowerBoard (J4.1 R30.1 R32.2)
Vsense_W: Controller (J13.1 U9.16), PowerBoard (J8.1 R49.1 R51.2)

## Assembly variants
External Regulator Board: not fitted C28 C29 C30 C31 C32 C33 C34 C35 C36 C37 C38 C39 C40 C41 C42 C43 C44 C45 C46 C47 C48 C49 D2 D3 D4 D5 L1 L2 Q1 Q2 Q3 Q6 Q7 Q9 R40 R43 R44 R45 R46 R51 R52 R53 R54 R55 R56 R57 R59 R60 R63 R64 R65 R66 R67 R68 R69 R70 U7 U9
Onboard Regulators: all parts fitted